# EAGLE design rony_hall_sensor (EAGLE 8.2.0)
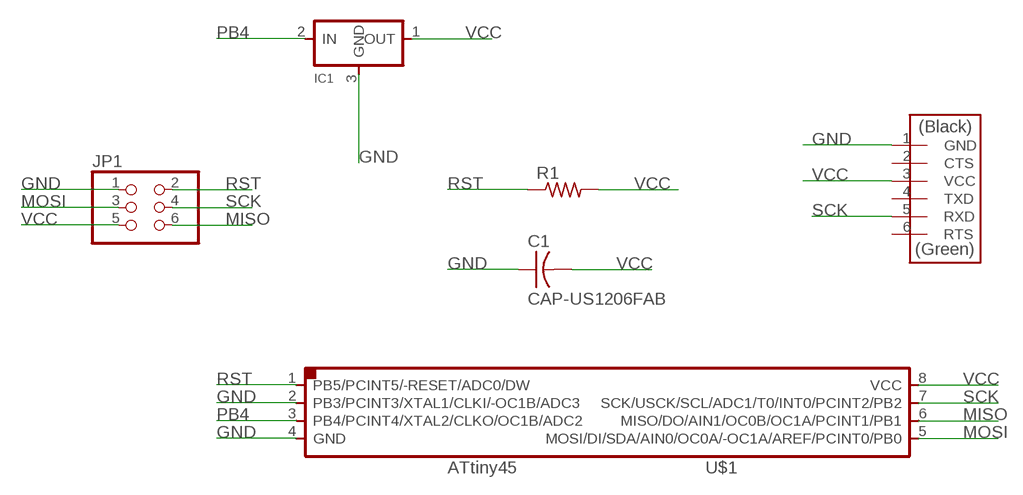
[diagram p0: schematic, sheet 1]

## Parts
C1  CAP-US1206FAB  [C1206FAB]
IC1  REGULATORSOT23  [SOT23]
JP1  PINHD-2X3-SMD  [2X03SMD]
R1  RES-US1206FAB  [R1206FAB]
U$1  ATTINY45SI  [SOIC8]
U$2  FTDI-SMD-HEADER  [1X06SMD]

## Nets
GND: C1.1 IC1.3(GND) JP1.1 U$1.2(PB3/PCINT3/XTAL1/CLKI/-OC1B/ADC3) U$1.4(GND) U$2.1(GND)
MISO: JP1.6 U$1.6(MISO/DO/AIN1/OC0B/OC1A/PCINT1/PB1)
MOSI: JP1.3 U$1.5(MOSI/DI/SDA/AIN0/OC0A/-OC1A/AREF/PCINT0/PB0)
PB4: IC1.2(IN) U$1.3(PB4/PCINT4/XTAL2/CLKO/OC1B/ADC2)
RST: JP1.2 R1.1 U$1.1(PB5/PCINT5/-RESET/ADC0/DW)
SCK: JP1.4 U$1.7(SCK/USCK/SCL/ADC1/T0/INT0/PCINT2/PB2) U$2.5(RXD)
VCC: C1.2 IC1.1(OUT) JP1.5 R1.2 U$1.8(VCC) U$2.3(VCC)
Unconnected: U$2.2(CTS) U$2.4(TXD) U$2.6(RTS)

## Library data of the parts
C1 = fab:CAP-US
IC1 = fab:REGULATOR
JP1 = fab:PINHD-2X3-SMD: PIN HEADER
R1 = fab:RES-US: Resistor (US Symbol) Variants with postfix FAB are widened to allow the routing of internal traces
U$1 = fab:ATTINY45
U$2 = fab:FTDI-SMD-HEADER

## Board
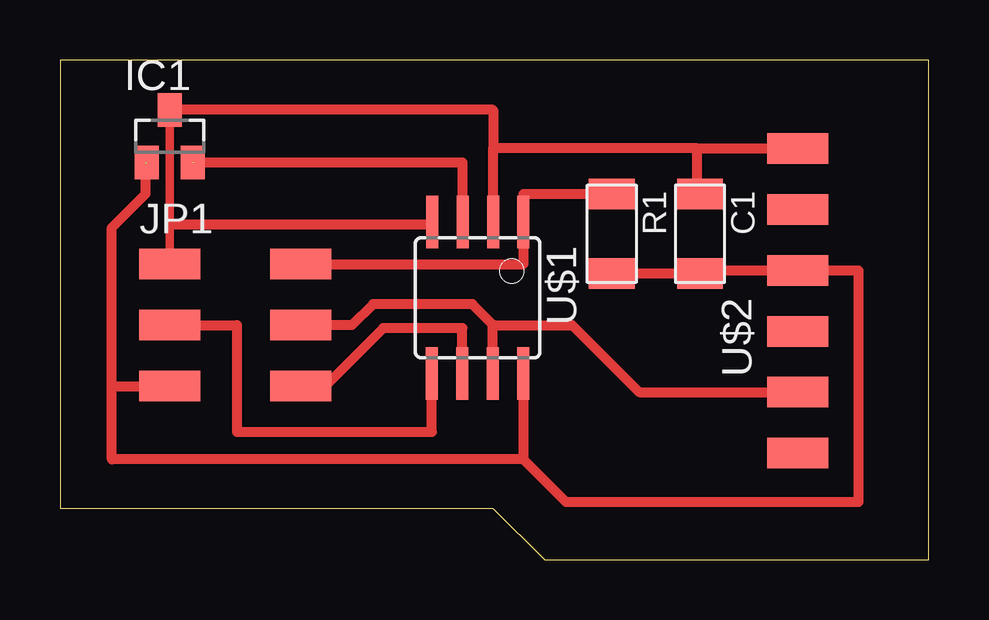
[diagram p1: board, top side]

Size 36.2 x 20.83 mm. Coordinates in mm from the lower left corner, seen from the top.
Outline: 0,2.16 18.03,2.16 20.19,0 36.2,0 36.2,20.83 0,20.83 0,2.16
Copper layers (1*16): Top 0.035mm / dielectric 1.5mm / Bottom 0.035mm
Design rules "guy_output *": minimum track width 16mil, minimum drill 0.35mm, track to track 0.6mm, track to pad 0.2mm, pad to pad 0.205mm, via to via 0.205mm, smd to smd 6mil, copper to edge 40mil, drill to drill 6mil, minimum pad ring 10mil, minimum via ring 8mil, stop-mask expansion 4mil, vias tented up to drill 0mil, thermal gap 10mil

### Footprints (pad centres in the part's own frame; a part is rotated, then mirrored left to right if it is on the bottom)
C1206FAB = smd 1.27 x 1.905: 1 -1.651,0; 2 1.651,0
SOT23 = smd 1 x 1.4: 1 -0.95,-1.1; 2 0.95,-1.1; 3 0,1.1
2X03SMD = smd 2.54 x 1.27: 1 -2.54,2.54; 2 2.92,2.54; 3 -2.54,0; 4 2.92,0; 5 -2.54,-2.54; 6 2.92,-2.54
R1206FAB = smd 1.27 x 1.905: 1 -1.651,0; 2 1.651,0
SOIC8 = smd 0.5 x 2.2: 1 -1.905,-3.154; 2 -0.645,-3.154; 3 0.625,-3.154; 4 1.895,-3.154; 5 1.905,3.154; 6 0.635,3.154; 7 -0.635,3.154; 8 -1.905,3.154
1X06SMD = smd 2.54 x 1.27: 1 0,6.35; 2 0,3.81; 3 0,1.27; 4 0,-1.27; 5 0,-3.81; 6 0,-6.35

### Placement (x,y rotation side)
C1  26.67,13.59 270 top
IC1  4.57,17.65 0 top
JP1  7.11,9.78 0 top
R1  22.99,13.59 270 top
U$1  17.4,10.92 180 top
U$2  30.73,10.79 0 top

### Tracks (layer width: path | path; a pad name or v marks a point on that pad's centre or on a via)
GND
  Top 0.356: 4.57,17.53 IC1.3 4.57,13.97 JP1.1
  Top 0.406: U$1.2 18.04,17.14 | IC1.3 18.04,18.75 18.04,17.14 | 26.54,17.14 18.04,17.14 | 26.54,17.14 U$2.1 | U$1.4 15.5,13.97 4.57,13.97 | C1.1 26.54,15.24 26.54,17.14
MISO
  Top 0.406: U$1.6 16.76,9.65 13.46,9.65 11.05,7.24 JP1.6
MOSI
  Top 0.406: JP1.3 7.37,9.78 7.37,5.33 15.49,5.33 U$1.5
PB4  (1 unrouted)
  Top 0.406: U$1.3 16.77,16.55 5.58,16.55
RST
  Top 0.406: JP1.2 19.3,12.32 U$1.1 19.3,15.24 R1.1
SCK
  Top 0.406: JP1.4 12.17,9.78 13.04,10.66 17.18,10.66 18.03,9.8 18.03,9.78 | U$1.7 18.03,9.78 | 18.03,9.78 21.34,9.78 24.13,6.98 U$2.5
VCC  (1 unrouted)
  Top 0.406: 2.16,7.24 JP1.5 | 2.16,7.24 2.16,13.84 3.57,15.25 3.57,16.55 | U$1.8 19.3,4.19 | 19.3,4.19 2.16,4.19 2.16,7.24 | 19.3,4.19 21.08,2.41 33.27,2.41 33.27,12.07 U$2.3 26.67,12.07 C1.2 R1.2